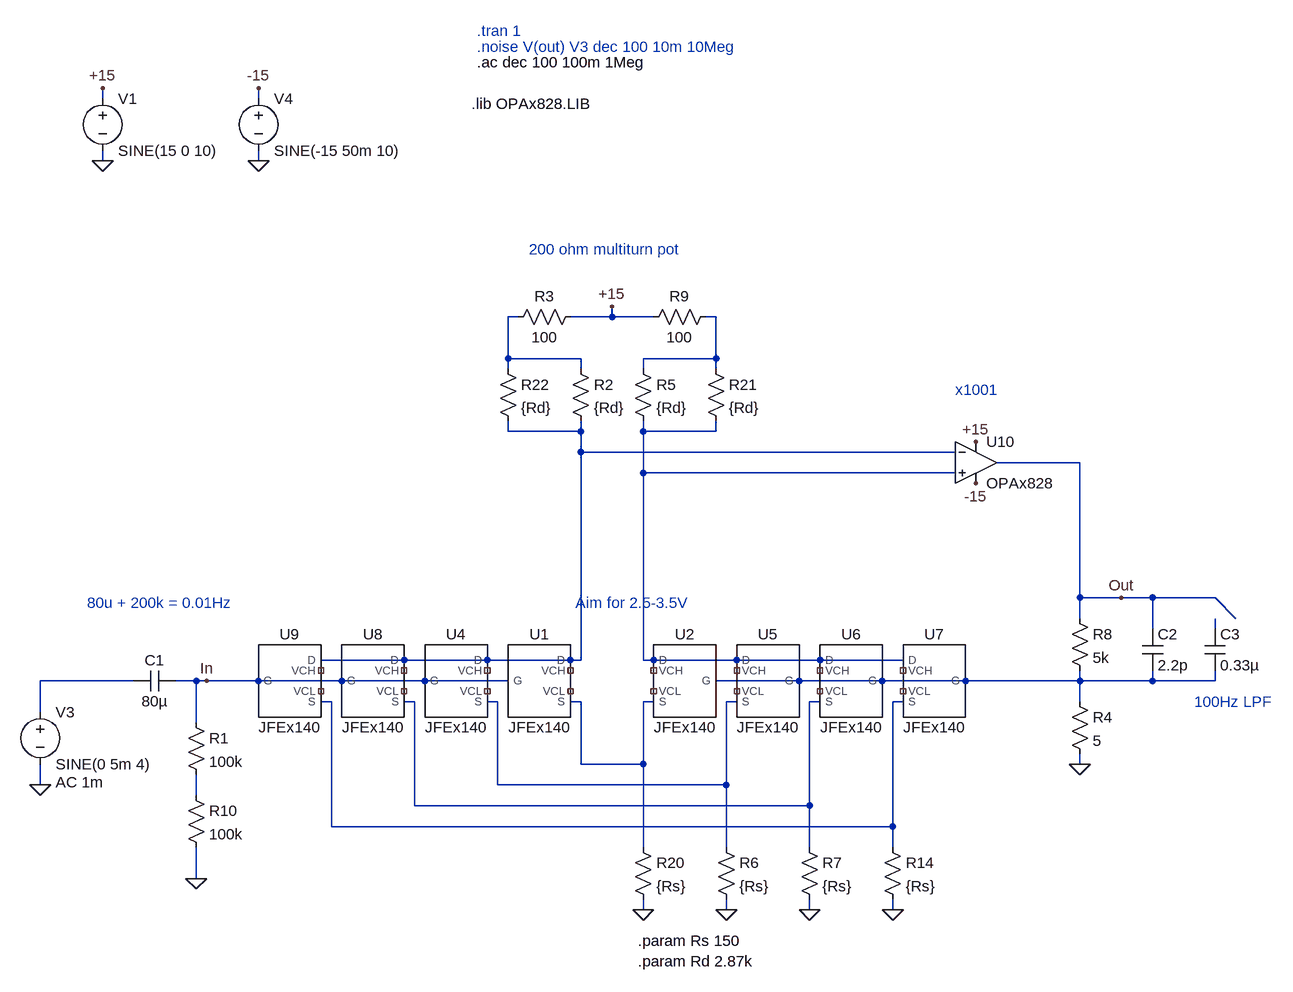
[diagram p0: schematic JFE2140 differential JFET amplifier.asc]
JFE2140 differential JFET amplifier.asc, the LTspice schematic file:
Version 4
SHEET 1 2084 932
WIRE -496 -736 -496 -752
WIRE -256 -736 -256 -752
WIRE -496 -640 -496 -656
WIRE -256 -640 -256 -656
WIRE 144 -400 128 -400
WIRE 288 -400 288 -416
WIRE 288 -400 224 -400
WIRE 352 -400 288 -400
WIRE 448 -400 432 -400
WIRE 128 -336 128 -400
WIRE 240 -336 128 -336
WIRE 448 -336 448 -400
WIRE 448 -336 336 -336
WIRE 128 -320 128 -336
WIRE 240 -320 240 -336
WIRE 336 -320 336 -336
WIRE 448 -320 448 -336
WIRE 128 -224 128 -240
WIRE 240 -224 240 -240
WIRE 240 -224 128 -224
WIRE 336 -224 336 -240
WIRE 448 -224 448 -240
WIRE 448 -224 336 -224
WIRE 240 -192 240 -224
WIRE 816 -192 240 -192
WIRE 1008 -176 880 -176
WIRE 336 -160 336 -224
WIRE 816 -160 336 -160
WIRE 1008 32 1008 -176
WIRE 1072 32 1008 32
WIRE 1120 32 1072 32
WIRE 1216 32 1120 32
WIRE 1008 64 1008 32
WIRE 1248 64 1216 32
WIRE 1120 80 1120 32
WIRE 1216 80 1216 64
WIRE -32 128 -160 128
WIRE 96 128 -32 128
WIRE 224 128 96 128
WIRE 240 128 240 -192
WIRE 240 128 224 128
WIRE 336 128 336 -160
WIRE 352 128 336 128
WIRE 480 128 352 128
WIRE 608 128 480 128
WIRE 736 128 608 128
WIRE -448 160 -592 160
WIRE -352 160 -384 160
WIRE -336 160 -352 160
WIRE -256 160 -336 160
WIRE -128 160 -256 160
WIRE 0 160 -128 160
WIRE 128 160 0 160
WIRE 576 160 448 160
WIRE 704 160 576 160
WIRE 832 160 704 160
WIRE 1008 160 1008 144
WIRE 1008 160 832 160
WIRE 1120 160 1120 144
WIRE 1120 160 1008 160
WIRE 1216 160 1216 144
WIRE 1216 160 1120 160
WIRE -144 192 -160 192
WIRE -16 192 -32 192
WIRE 112 192 96 192
WIRE 240 192 224 192
WIRE 352 192 336 192
WIRE 480 192 464 192
WIRE 608 192 592 192
WIRE 736 192 720 192
WIRE 1008 192 1008 160
WIRE -592 208 -592 160
WIRE -352 224 -352 160
WIRE 240 288 240 192
WIRE 336 288 336 192
WIRE 336 288 240 288
WIRE 1008 288 1008 272
WIRE -592 320 -592 288
WIRE 112 320 112 192
WIRE 464 320 464 192
WIRE 464 320 112 320
WIRE -352 336 -352 304
WIRE -16 352 -16 192
WIRE 592 352 592 192
WIRE 592 352 -16 352
WIRE -144 384 -144 192
WIRE 720 384 720 192
WIRE 720 384 -144 384
WIRE 336 416 336 288
WIRE 464 416 464 320
WIRE 592 416 592 352
WIRE 720 416 720 384
WIRE -352 464 -352 416
WIRE 336 512 336 496
WIRE 464 512 464 496
WIRE 592 512 592 496
WIRE 720 512 720 496
FLAG -496 -752 +15
FLAG -496 -640 0
FLAG 336 512 0
FLAG -352 464 0
FLAG -592 320 0
FLAG -256 -752 -15
FLAG -256 -640 0
FLAG 848 -208 +15
FLAG 848 -144 -15
FLAG 288 -416 +15
FLAG 1008 288 0
FLAG -336 160 In
FLAG 464 512 0
FLAG 592 512 0
FLAG 720 512 0
FLAG 1072 32 Out
DATAFLAG -544 160 ""
SYMBOL JFEx140 176 160 R0
SYMATTR InstName U1
SYMBOL JFEx140 400 160 M0
SYMATTR InstName U2
SYMBOL cap -384 144 R90
WINDOW 0 0 32 VBottom 2
WINDOW 3 32 32 VTop 2
SYMATTR InstName C1
SYMATTR Value 80µ
SYMBOL res -368 208 R0
SYMATTR InstName R1
SYMATTR Value 100k
SYMBOL voltage -496 -752 R0
WINDOW 123 0 0 Left 0
WINDOW 39 0 0 Left 0
SYMATTR InstName V1
SYMATTR Value SINE(15 0 10)
SYMBOL voltage -592 192 R0
WINDOW 123 24 124 Left 2
WINDOW 39 0 0 Left 0
SYMATTR Value2 AC 1m
SYMATTR InstName V3
SYMATTR Value SINE(0 5m 4)
SYMBOL voltage -256 -752 R0
WINDOW 123 0 0 Left 0
WINDOW 39 0 0 Left 0
SYMATTR InstName V4
SYMATTR Value SINE(-15 50m 10)
SYMBOL res 224 -336 R0
SYMATTR InstName R2
SYMATTR Value {Rd}
SYMBOL res 320 -336 R0
SYMATTR InstName R5
SYMATTR Value {Rd}
SYMBOL res 992 176 R0
SYMATTR InstName R4
SYMATTR Value 5
SYMBOL res 992 48 R0
SYMATTR InstName R8
SYMATTR Value 5k
SYMBOL JFEx140 48 160 R0
SYMATTR InstName U4
SYMBOL JFEx140 528 160 M0
SYMATTR InstName U5
SYMBOL JFEx140 656 160 M0
SYMATTR InstName U6
SYMBOL JFEx140 784 160 M0
SYMATTR InstName U7
SYMBOL JFEx140 -80 160 R0
SYMATTR InstName U8
SYMBOL JFEx140 -208 160 R0
SYMATTR InstName U9
SYMBOL OpAmps\\opamp2 848 -240 R0
SYMATTR InstName U10
SYMATTR Value OPAx828
SYMBOL cap 1104 80 R0
SYMATTR InstName C2
SYMATTR Value 2.2p
SYMBOL res 320 400 R0
SYMATTR InstName R20
SYMATTR Value {Rs}
SYMBOL res 432 -336 R0
SYMATTR InstName R21
SYMATTR Value {Rd}
SYMBOL res 112 -336 R0
SYMATTR InstName R22
SYMATTR Value {Rd}
SYMBOL res 448 400 R0
SYMATTR InstName R6
SYMATTR Value {Rs}
SYMBOL res 576 400 R0
SYMATTR InstName R7
SYMATTR Value {Rs}
SYMBOL res 704 400 R0
SYMATTR InstName R14
SYMATTR Value {Rs}
SYMBOL res 240 -416 R90
WINDOW 0 0 56 VBottom 2
WINDOW 3 32 56 VTop 2
SYMATTR InstName R3
SYMATTR Value 100
SYMBOL res 448 -416 R90
WINDOW 0 0 56 VBottom 2
WINDOW 3 32 56 VTop 2
SYMATTR InstName R9
SYMATTR Value 100
SYMBOL cap 1200 80 R0
SYMATTR InstName C3
SYMATTR Value 0.33µ
SYMBOL res -368 320 R0
SYMATTR InstName R10
SYMATTR Value 100k
TEXT 80 -840 Left 2 ;.tran 1
TEXT 80 -816 Left 2 ;.noise V(out) V3 dec 100 10m 10Meg
TEXT 80 -792 Left 2 !.ac dec 100 100m 1Meg
TEXT 816 -288 Left 2 ;x1001
TEXT 72 -728 Left 2 !.lib OPAx828.LIB
TEXT 232 40 Left 2 ;Aim for 2.5-3.5V
TEXT 328 560 Left 2 !.param Rs 150\n.param Rd 2.87k
TEXT 160 -504 Left 2 ;200 ohm multiturn pot
TEXT -520 40 Left 2 ;80u + 200k = 0.01Hz
TEXT 1184 192 Left 2 ;100Hz LPF

The netlist it stands for:
* JFE2140 differential JFET amplifier.asc
XU1 N003 In N011 NC_01 NC_02 JFEx140  ; pins D G S VCH VCL
XU2 N004 N007 N011 NC_03 NC_04 JFEx140  ; pins D G S VCH VCL
C1 In N006 80µ
R1 In N012 100k
V1 +15 0 SINE(15 0 10)
V3 N006 0 SINE(0 5m 4) AC 1m
V4 -15 0 SINE(-15 50m 10)
R2 N001 N003 {Rd}
R5 N002 N004 {Rd}
R4 N007 0 5
R8 Out N007 5k
XU4 N003 In N010 NC_05 NC_06 JFEx140  ; pins D G S VCH VCL
XU5 N004 N007 N010 NC_07 NC_08 JFEx140  ; pins D G S VCH VCL
XU6 N004 N007 N009 NC_09 NC_10 JFEx140  ; pins D G S VCH VCL
XU7 N004 N007 N008 NC_11 NC_12 JFEx140  ; pins D G S VCH VCL
XU8 N003 In N009 NC_13 NC_14 JFEx140  ; pins D G S VCH VCL
XU9 N003 In N008 NC_15 NC_16 JFEx140  ; pins D G S VCH VCL
XU10 N004 N003 +15 -15 Out OPAx828  ; pins In+ In- V+ V- OUT
C2 Out N007 2.2p
R20 N011 0 {Rs}
R21 N002 N004 {Rd}
R22 N001 N003 {Rd}
R6 N010 0 {Rs}
R7 N009 0 {Rs}
R14 N008 0 {Rs}
R3 +15 N001 100
R9 N002 +15 100
C3 N005 N007 0.33µ
R10 N012 0 100k
* .tran 1
* .noise V(out) V3 dec 100 10m 10Meg
.ac dec 100 100m 1Meg
* x1001
.lib OPAx828.LIB
* Aim for 2.5-3.5V
.param Rs 150
.param Rd 2.87k
* 200 ohm multiturn pot
* 80u + 200k = 0.01Hz
* 100Hz LPF
.lib C:\GitHub\PCBs\LNA\Simulations\jfex140.lib
.backanno
.end